# EAGLE schematic Vector Table (EAGLE 9.6.1)
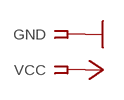
[diagram p0: schematic, sheet 1]

## Parts
GND  SSW-101-02-G-S-RA  [SSW-101-02-G-S-RA]
VCC  SSW-101-02-G-S-RA  [SSW-101-02-G-S-RA]

## Nets
GND: GND.1
VCC: VCC.1

## Library data of the parts
GND VCC = con-samtec:SSW-101-02-G-S: THROUGH-HOLE .025" SQ POST SOCKET Source: Samtec SSW.pdf; MF: Samtec Inc.; MPN: SSW-101-02-G-S-RA; OC_FARNELL: unknown; OC_NEWARK: 11P9337